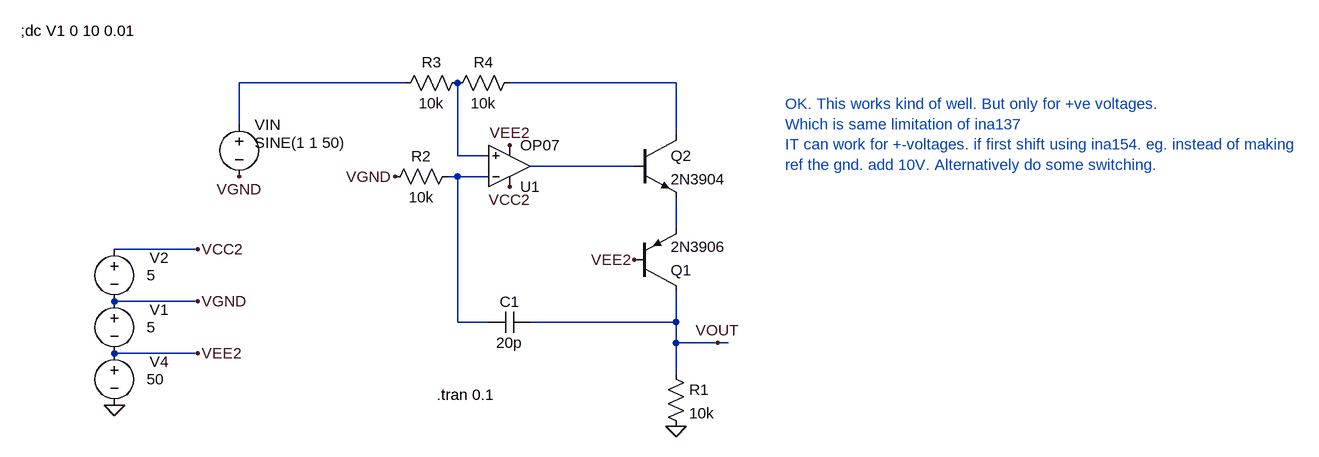
[diagram p0: schematic Draft15.asc]
Draft15.asc, the LTspice schematic file:
Version 4
SHEET 1 1712 680
WIRE 256 -32 0 -32
WIRE 672 -32 416 -32
WIRE 0 32 0 -32
WIRE 672 48 672 -32
WIRE 336 80 336 -32
WIRE 384 80 336 80
WIRE 608 96 448 96
WIRE 336 112 320 112
WIRE 384 112 336 112
WIRE 672 192 672 144
WIRE -64 224 -192 224
WIRE -64 304 -192 304
WIRE 336 336 336 112
WIRE 384 336 336 336
WIRE 672 336 672 288
WIRE 672 336 448 336
WIRE 672 368 672 336
WIRE 736 368 672 368
WIRE 752 368 736 368
WIRE -64 384 -192 384
WIRE 672 416 672 368
FLAG -192 464 0
FLAG -64 384 VEE2
FLAG -64 224 VCC2
FLAG 672 496 0
FLAG 416 64 VEE2
FLAG 416 128 VCC2
FLAG 736 368 VOUT
FLAG -64 304 VGND
FLAG 0 112 VGND
FLAG 240 112 VGND
FLAG 608 240 VEE2
SYMBOL voltage 0 16 R0
WINDOW 123 0 0 Left 0
WINDOW 39 0 0 Left 0
WINDOW 3 24 44 Left 2
SYMATTR Value SINE(1 1 50)
SYMATTR InstName VIN
SYMBOL voltage -192 368 R0
WINDOW 0 54 29 Left 2
WINDOW 3 50 56 Left 2
WINDOW 123 0 0 Left 0
WINDOW 39 0 0 Left 0
SYMATTR InstName V4
SYMATTR Value 50
SYMBOL pnp 608 288 M180
SYMATTR InstName Q1
SYMATTR Value 2N3906
SYMBOL voltage -192 288 R0
WINDOW 0 54 29 Left 2
WINDOW 3 50 56 Left 2
WINDOW 123 0 0 Left 0
WINDOW 39 0 0 Left 0
SYMATTR InstName V1
SYMATTR Value 5
SYMBOL res 656 400 R0
SYMATTR InstName R1
SYMATTR Value 10k
SYMBOL res 352 -48 R90
WINDOW 0 0 56 VBottom 2
WINDOW 3 32 56 VTop 2
SYMATTR InstName R3
SYMATTR Value 10k
SYMBOL res 432 -48 R90
WINDOW 0 0 56 VBottom 2
WINDOW 3 32 56 VTop 2
SYMATTR InstName R4
SYMATTR Value 10k
SYMBOL npn 608 48 R0
SYMATTR InstName Q2
SYMATTR Value 2N3904
SYMBOL voltage -192 208 R0
WINDOW 0 54 29 Left 2
WINDOW 3 50 56 Left 2
WINDOW 123 0 0 Left 0
WINDOW 39 0 0 Left 0
SYMATTR InstName V2
SYMATTR Value 5
SYMBOL OpAmps\\OP07 416 160 M180
SYMATTR InstName U1
SYMBOL cap 448 320 R90
WINDOW 0 0 32 VBottom 2
WINDOW 3 32 32 VTop 2
SYMATTR InstName C1
SYMATTR Value 20p
SYMBOL res 336 96 R90
WINDOW 0 0 56 VBottom 2
WINDOW 3 32 56 VTop 2
SYMATTR InstName R2
SYMATTR Value 10k
TEXT -336 -112 Left 2 !;dc V1 0 10 0.01
TEXT 304 448 Left 2 !.tran 0.1
TEXT 840 0 Left 2 ;OK. This works kind of well. But only for +ve voltages.\nWhich is same limitation of ina137\nIT can work for +-voltages. if first shift using ina154. eg. instead of making\nref the gnd. add 10V. Alternatively do some switching.

The netlist it stands for:
* Draft15.asc
VIN N001 VGND SINE(1 1 50)
V4 VEE2 0 50
Q1 VOUT VEE2 N006 0 2N3906
V1 VGND VEE2 5
R1 VOUT 0 10k
R3 N003 N001 10k
R4 N002 N003 10k
Q2 N002 N004 N006 0 2N3904
V2 VCC2 VGND 5
XU1 N003 N005 VCC2 VEE2 N004 LT1001  ; OP07, pins In+ In- V+ V- OUT
C1 VOUT N005 20p
R2 N005 VGND 10k
.model NPN NPN
.model PNP PNP
.lib standard.bjt
;dc V1 0 10 0.01
.tran 0.1
* OK. This works kind of well. But only for +ve voltages.
* Which is same limitation of ina137
* IT can work for +-voltages. if first shift using ina154. eg. instead of making
* ref the gnd. add 10V. Alternatively do some switching.
.lib LTC.lib
.backanno
.end